# Altium schematic sheet MainBoard Pro Mini.SchDoc
size A4; SheetNumber: 1; SheetTotal: 2
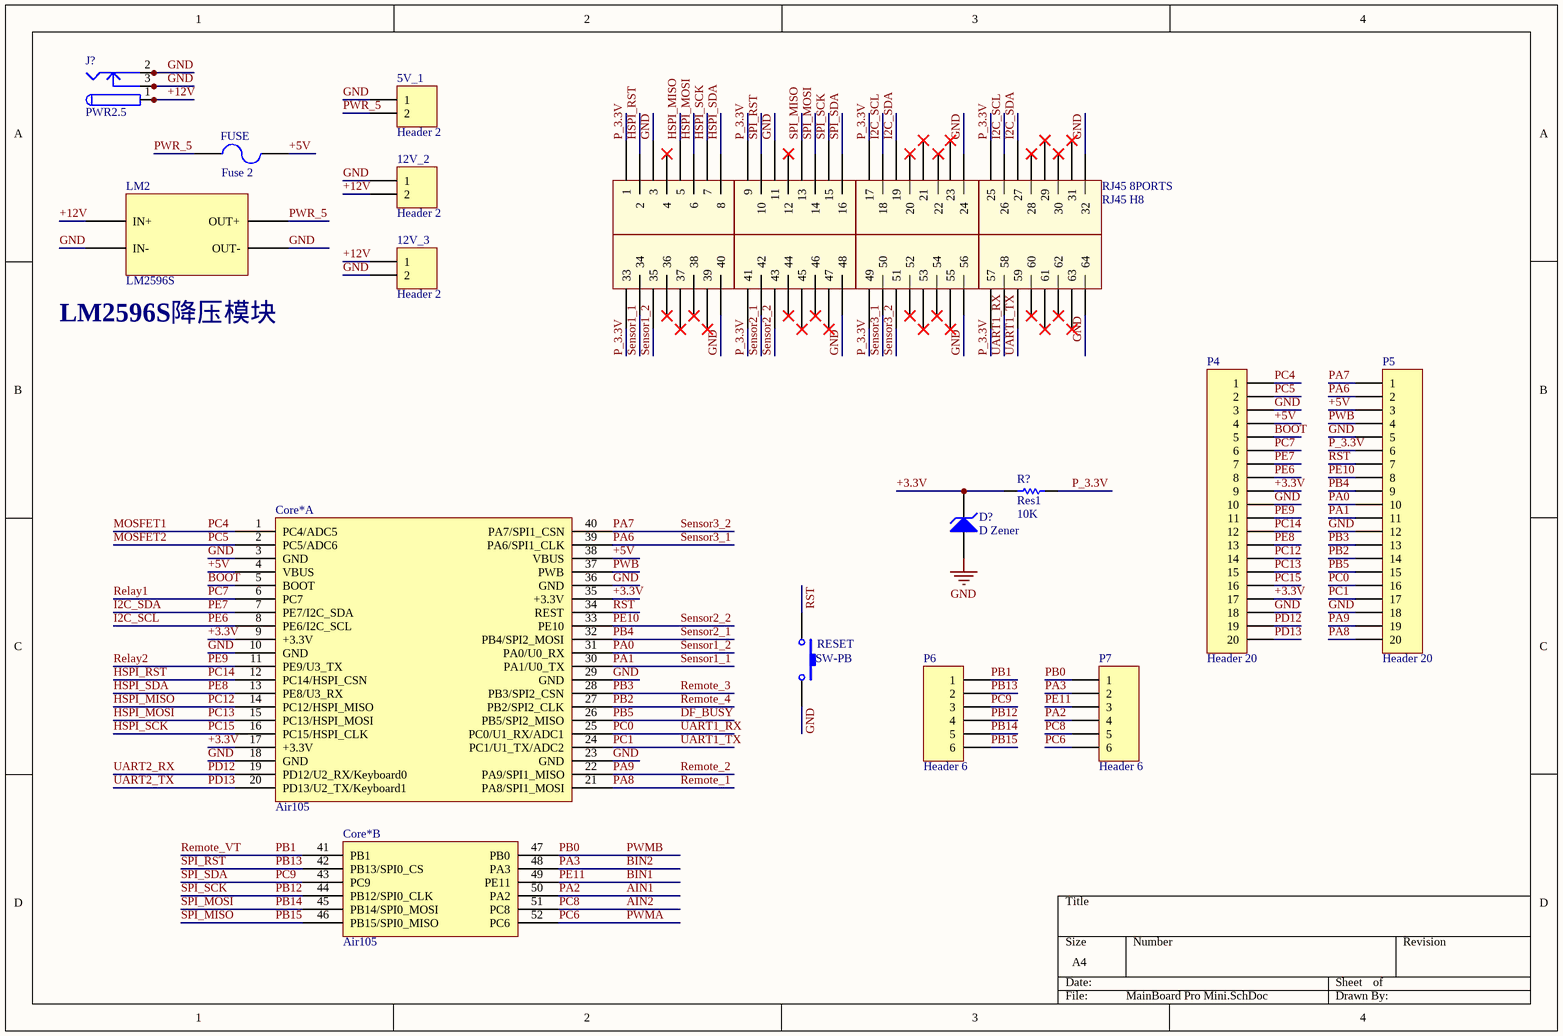
[diagram p0: MainBoard Pro Mini.SchDoc]

## Parts
5V_1  Header 2  [KF2EDGK5.0-LI-2P]
12V_2  Header 2  [KF2EDGK5.0-LI-2P]
12V_3  Header 2  [KF2EDGK5.0-WI-2P]
Core*  Air105  [Luat_Air105]  (parts A,B of 2)
D?  D Zener  [LLDS  // LS-34]
FUSE  Fuse 2  [FU 5x20]
J?  PWR2.5  [PJ-017D]
LM2  LM2596S  [MP1584EN]
P4  Header 20  [HDR1X20]
P5  Header 20  [HDR1X20]
P6  Header 6  [HDR1X6]
P7  Header 6  [HDR1X6]
R?  Res1  value 10K  [0603/1608 R0]
RESET  SW-PB  [PB_ALPS_SKHHLQA010]
RJ45_8PORTS  RJ45 H8  [RJ45_8ports]

## Nets
GND: 5V_1.1 12V_2.1 12V_3.2 Core*.3(GND) Core*.10(GND) Core*.18(GND) Core*.23(GND) Core*.29(GND) Core*.36(GND) D?.1(A) J?.2 J?.2A J?.2B J?.3 J?.3A J?.3B LM2.1(IN-) LM2.3(OUT-) P4.3 P4.10 P4.18 P5.5 P5.12 P5.18 RESET.2 RJ45_8PORTS.3 RJ45_8PORTS.11 RJ45_8PORTS.24 RJ45_8PORTS.32 RJ45_8PORTS.40 RJ45_8PORTS.48 RJ45_8PORTS.56 RJ45_8PORTS.64
+3.3V: Core*.9(+3.3V) Core*.17(+3.3V) Core*.35(+3.3V) D?.2(K) P4.9 P4.17 R?.1
+5V: Core*.4(VBUS) Core*.38(VBUS) FUSE.2 P4.4 P5.3
+12V: 12V_2.2 12V_3.1 J?.1 J?.1A J?.1B LM2.2(IN+)
AIN1: Core*.50(PA2) P7.4  [also labelled PA2]
AIN2: Core*.51(PC8) P7.5  [also labelled PC8]
BIN1: Core*.49(PE11) P7.3  [also labelled PE11]
BIN2: Core*.48(PA3) P7.2  [also labelled PA3]
BOOT: Core*.5(BOOT) P4.5
DF_BUSY: Core*.26(PB5/SPI2_MISO) P5.15  [also labelled PB5]
HSPI_MISO: Core*.14(PC12/HSPI_MISO) P4.14 RJ45_8PORTS.5  [also labelled PC12]
HSPI_MOSI: Core*.15(PC13/HSPI_MOSI) P4.15 RJ45_8PORTS.6  [also labelled PC13]
HSPI_RST: Core*.12(PC14/HSPI_CSN) P4.12 RJ45_8PORTS.2  [also labelled PC14]
HSPI_SCK: Core*.16(PC15/HSPI_CLK) P4.16 RJ45_8PORTS.7  [also labelled PC15]
HSPI_SDA: Core*.13(PE8/U3_RX) P4.13 RJ45_8PORTS.8  [also labelled PE8]
I2C_SCL: Core*.8(PE6/I2C_SCL) P4.8 RJ45_8PORTS.18 RJ45_8PORTS.26  [also labelled PE6]
I2C_SDA: Core*.7(PE7/I2C_SDA) P4.7 RJ45_8PORTS.19 RJ45_8PORTS.27  [also labelled PE7]
MOSFET1: Core*.1(PC4/ADC5) P4.1  [also labelled PC4]
MOSFET2: Core*.2(PC5/ADC6) P4.2  [also labelled PC5]
P_3.3V: P5.6 R?.2 RJ45_8PORTS.1 RJ45_8PORTS.9 RJ45_8PORTS.17 RJ45_8PORTS.25 RJ45_8PORTS.33 RJ45_8PORTS.41 RJ45_8PORTS.49 RJ45_8PORTS.57
PA0: Core*.31(PA0/U0_RX) P5.10 RJ45_8PORTS.35  [also labelled Sensor1_2]
PA1: Core*.30(PA1/U0_TX) P5.11 RJ45_8PORTS.34  [also labelled Sensor1_1]
PA6: Core*.39(PA6/SPI1_CLK) P5.2 RJ45_8PORTS.50  [also labelled Sensor3_1]
PA7: Core*.40(PA7/SPI1_CSN) P5.1 RJ45_8PORTS.51  [also labelled Sensor3_2]
PA8: Core*.21(PA8/SPI1_MOSI) P5.20  [also labelled Remote_1]
PA9: Core*.22(PA9/SPI1_MISO) P5.19  [also labelled Remote_2]
PB0: Core*.47(PB0) P7.1  [also labelled PWMB]
PB1: Core*.41(PB1) P6.1  [also labelled Remote_VT]
PB2: Core*.27(PB2/SPI2_CLK) P5.14  [also labelled Remote_4]
PB3: Core*.28(PB3/SPI2_CSN) P5.13  [also labelled Remote_3]
PB4: Core*.32(PB4/SPI2_MOSI) P5.9 RJ45_8PORTS.42  [also labelled Sensor2_1]
PB12: Core*.44(PB12/SPI0_CLK) P6.4 RJ45_8PORTS.15  [also labelled SPI_SCK]
PB13: Core*.42(PB13/SPI0_CS) P6.2 RJ45_8PORTS.10  [also labelled SPI_RST]
PB14: Core*.45(PB14/SPI0_MOSI) P6.5 RJ45_8PORTS.14  [also labelled SPI_MOSI]
PB15: Core*.46(PB15/SPI0_MISO) P6.6 RJ45_8PORTS.13  [also labelled SPI_MISO]
PC0: Core*.25(PC0/U1_RX/ADC1) P5.16 RJ45_8PORTS.58  [also labelled UART1_RX]
PC1: Core*.24(PC1/U1_TX/ADC2) P5.17 RJ45_8PORTS.59  [also labelled UART1_TX]
PC6: Core*.52(PC6) P7.6  [also labelled PWMA]
PC7: Core*.6(PC7) P4.6  [also labelled Relay1]
PC9: Core*.43(PC9) P6.3 RJ45_8PORTS.16  [also labelled SPI_SDA]
PD12: Core*.19(PD12/U2_RX/Keyboard0) P4.19  [also labelled UART2_RX]
PD13: Core*.20(PD13/U2_TX/Keyboard1) P4.20  [also labelled UART2_TX]
PE9: Core*.11(PE9/U3_TX) P4.11  [also labelled Relay2]
PE10: Core*.33(PE10) P5.8 RJ45_8PORTS.43  [also labelled Sensor2_2]
PWB: Core*.37(PWB) P5.4
PWR_5: 5V_1.2 FUSE.1 LM2.4(OUT+)
RST: Core*.34(REST) P5.7 RESET.1

Not connected (* = marked no-connect by the designer): RJ45_8PORTS 4* 12* 20* 21* 22* 23* 28* 29* 30* 31* 36* 37* 38* 39* 44* 45* 46* 47* 52* 53* 54* 55* 60* 61* 62* 63*

## Notes on the sheet
- (near LM2) LM2596S降压模块

## Library data of the parts
5V_1 12V_2 12V_3 = Header 2: Header, 2-Pin; LatestRevisionDate: 17-Jul-2002; LatestRevisionNote: Re-released for DXP Platform.; Publisher: Altium Limited
D? = D Zener: Zener Diode; Published: 8-Jun-2000; LatestRevisionDate: 17-Jul-2002; LatestRevisionNote: Re-released for DXP Platform.; PackageReference: DIODE-0.7; Publisher: Altium Limited
FUSE = Fuse 2: Fuse; Published: 8-Jun-2000; LatestRevisionDate: 17-Jul-2002; LatestRevisionNote: Re-released for DXP Platform.; PackageReference: PIN-W2/E2.8; Publisher: Altium Limited; PackageDescription: Thru-Hole; 2 Leads
J? = PWR2.5: Low Voltage Power Supply Connector; Published: 17-Dec-2003; DatasheetDocument: 09-May-2002; Publisher: Altium Limited; ComponentLink1Description: Manufacturer Link; ComponentLink1URL: http://domino.kycon.com/internet/Products.html
LM2 = LM2596S: 降压模块
P4 P5 = Header 20: Header, 20-Pin; LatestRevisionDate: 17-Jul-2002; LatestRevisionNote: Re-released for DXP Platform.; Publisher: Altium Limited
P6 P7 = Header 6: Header, 6-Pin; LatestRevisionDate: 17-Jul-2002; LatestRevisionNote: Re-released for DXP Platform.; Publisher: Altium Limited
R? = Res1: Resistor; Published: 8-Jun-2000; LatestRevisionDate: 17-Jul-2002; LatestRevisionNote: Re-released for DXP Platform.; PackageReference: AXIAL-0.3; Publisher: Altium Limited; PackageDescription: Axial Device, Thru-Hole; 2 Leads; 0.3 in Pin Spacing
RESET = SW-PB: 微动开关; Published: 24-Mar-1999; LatestRevisionDate: 17-Jul-2002; LatestRevisionNote: Re-released for DXP Platform.; PackageReference: SPST-2; Publisher: Altium Limited